# EAGLE schematic tssop24 (EAGLE 6.4)
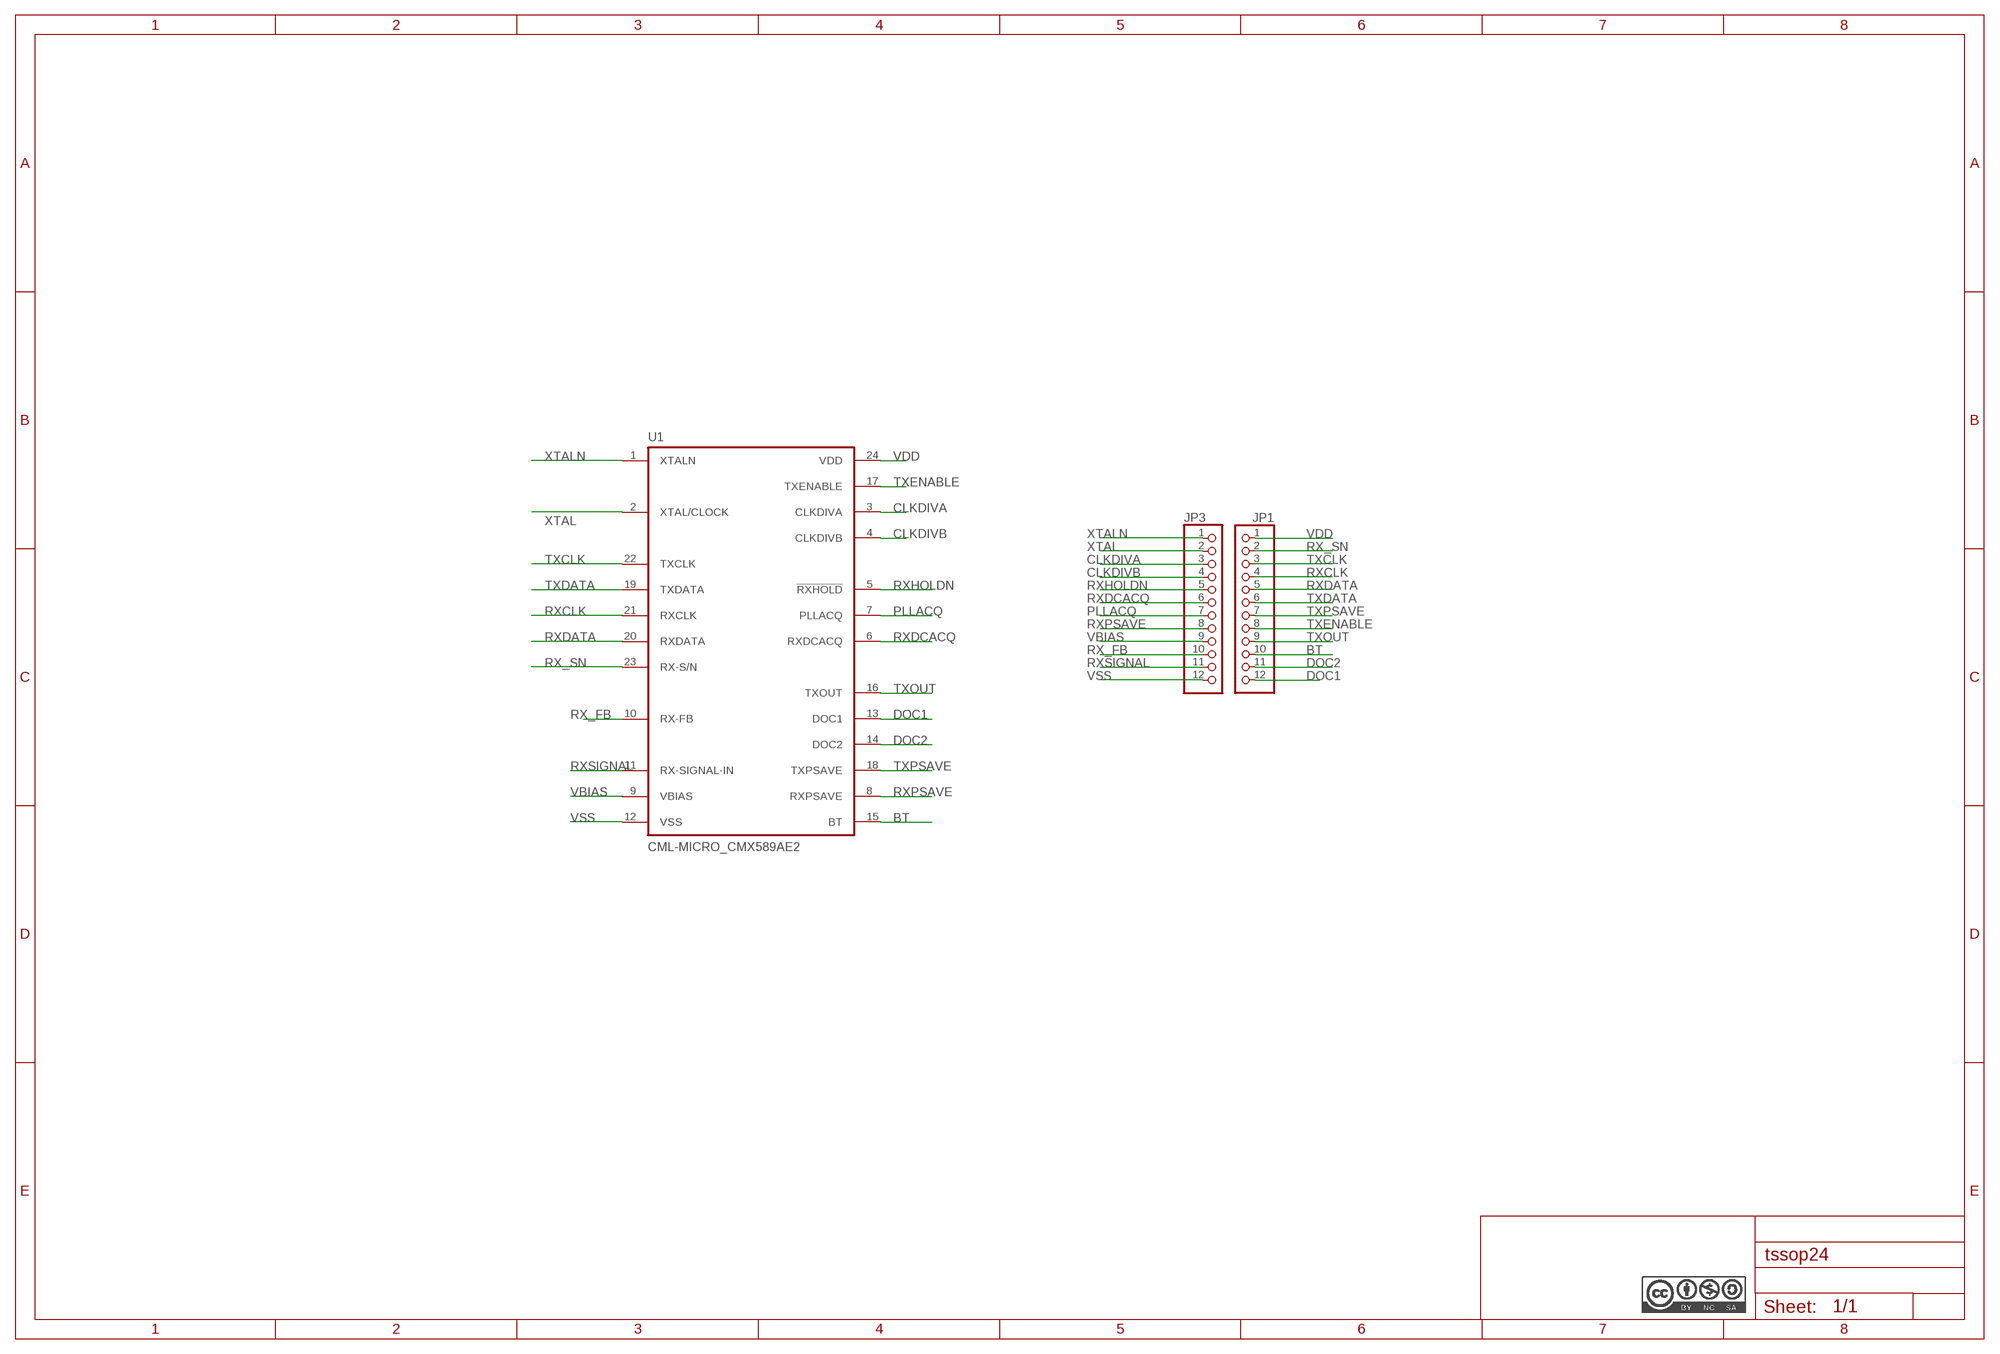
[diagram p0: schematic, sheet 1]

## Parts
JP1  PINHD-1X12-CB  [1X12-CB]
JP3  PINHD-1X12-CB  [1X12-CB]
U1  CML-MICRO_CMX589AE2  AIS_MK2_CML-MICRO_CMX589AE2  [AIS_MK2_CML-MICRO_TSSOP24]

## Nets
BT: JP1.10 U1.15(BT)
CLKDIVA: JP3.3 U1.3(CLKDIVA)
CLKDIVB: JP3.4 U1.4(CLKDIVB)
DOC1: JP1.12 U1.13(DOC1)
DOC2: JP1.11 U1.14(DOC2)
PLLACQ: JP3.7 U1.7(PLLACQ)
RX_FB: JP3.10 U1.10(RX-FB)
RX_SN: JP1.2 U1.23(RX-S/N)
RXCLK: JP1.4 U1.21(RXCLK)
RXDATA: JP1.5 U1.20(RXDATA)
RXDCACQ: JP3.6 U1.6(RXDCACQ)
RXHOLDN: JP3.5 U1.5(!RXHOLD!)
RXPSAVE: JP3.8 U1.8(RXPSAVE)
RXSIGNAL: JP3.11 U1.11(RX-SIGNAL-IN)
TXCLK: JP1.3 U1.22(TXCLK)
TXDATA: JP1.6 U1.19(TXDATA)
TXENABLE: JP1.8 U1.17(TXENABLE)
TXOUT: JP1.9 U1.16(TXOUT)
TXPSAVE: JP1.7 U1.18(TXPSAVE)
VBIAS: JP3.9 U1.9(VBIAS)
VDD: JP1.1 U1.24(VDD)
VSS: JP3.12 U1.12(VSS)
XTAL: JP3.2 U1.2(XTAL/CLOCK)
XTALN: JP3.1 U1.1(XTALN)

## Library data of the parts
JP1 JP3 = adafruit:PINHD-1X12: PIN HEADER
U1 = mylibrary:AIS_MK2_CML-MICRO_CMX589A: HIGH-SPEED GMSK MODEM

## Net classes
1 pwr: width 0.381 mm